# EAGLE design kitt_db01 (EAGLE 7.7.0)
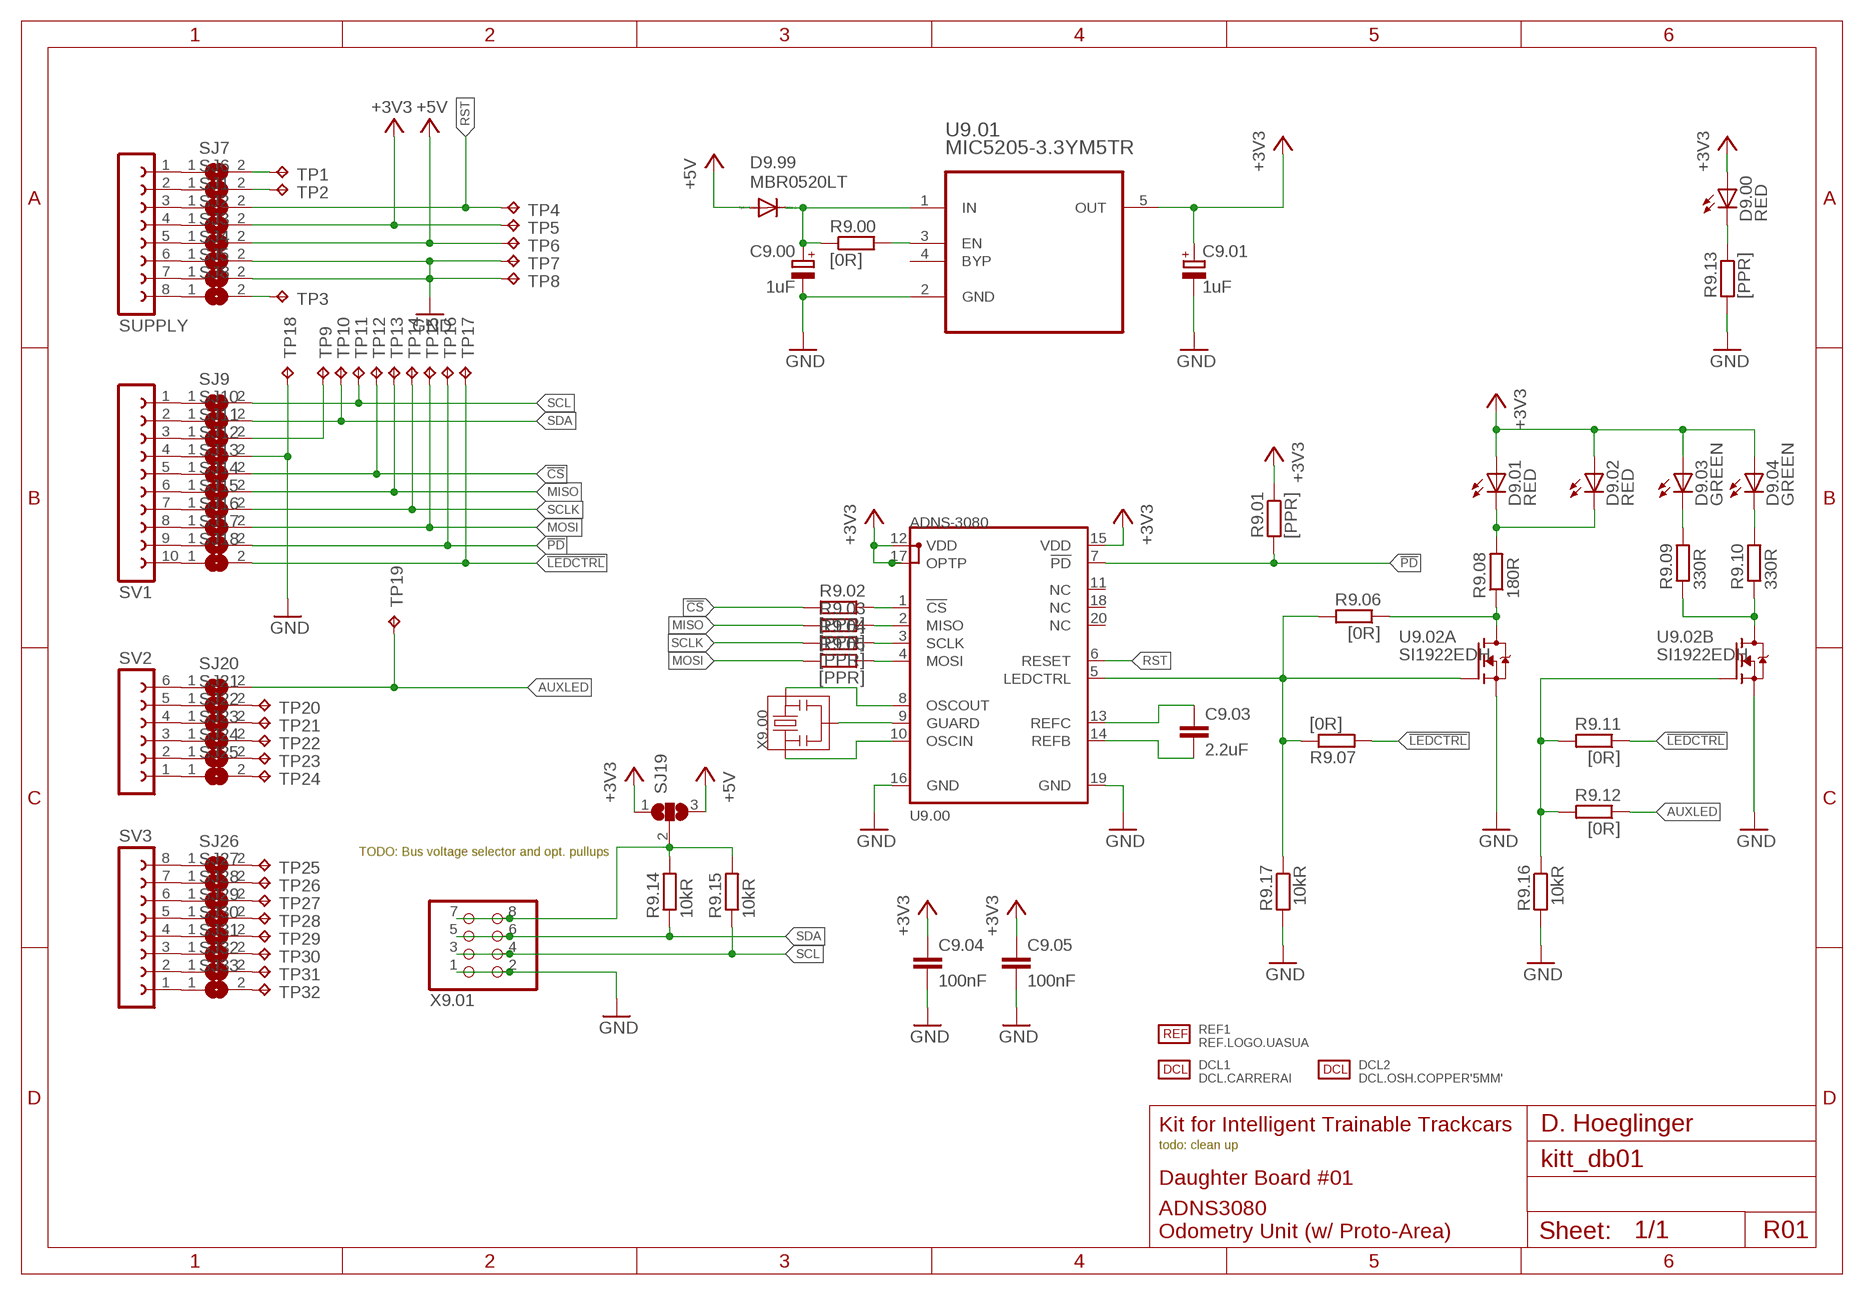
[diagram p0: schematic, sheet 1]

## Parts
C9.00  1uF  CPOL-EUA/3216-18W  [A/3216-18W]
C9.01  1uF  CPOL-EUA/3216-18W  [A/3216-18W]
C9.03  2.2uF  C-EUC1608  [C1608]
C9.04  100nF  C-EUC0805K  [C0805K]
C9.05  100nF  C-EUC0805K  [C0805K]
D9.00  RED  LEDCHIP-LED0805  [CHIP-LED0805]
D9.01  RED  LED5MM  [LED5MM]
D9.02  RED  LEDCHIP-LED0805  [CHIP-LED0805]
D9.03  GREEN  LEDCHIP-LED0805  [CHIP-LED0805]
D9.04  GREEN  LEDCHIP-LED0805  [CHIP-LED0805]
D9.99  MBR0520LT  [SOD123]
DCL1  DCL.CARRERAI  [DCL.LOGO-CARRERAI.W30MM]
DCL2  DCL.OSH.COPPER'5MM'  [DCL.LOGO-OSH.5MM]
R9.00  [0R]  R-EU_R0805  [R0805]
R9.01  [PPR]  R-EU_R0805  [R0805]
R9.02  [PPR]  R-EU_R0805  [R0805]
R9.03  [PPR]  R-EU_R0805  [R0805]
R9.04  [PPR]  R-EU_R0805  [R0805]
R9.05  [PPR]  R-EU_R0805  [R0805]
R9.06  [0R]  R-EU_R0805  [R0805]
R9.07  [0R]  R-EU_R0805  [R0805]
R9.08  180R  R-EU_R0805  [R0805]
R9.09  330R  R-EU_R0805  [R0805]
R9.10  330R  R-EU_R0805  [R0805]
R9.11  [0R]  R-EU_R0805  [R0805]
R9.12  [0R]  R-EU_R0805  [R0805]
R9.13  [PPR]  R-EU_R0805  [R0805]
R9.14  10kR  R-EU_R0805  [R0805]
R9.15  10kR  R-EU_R0805  [R0805]
R9.16  10kR  R-EU_R0805  [R0805]
R9.17  10kR  R-EU_R0805  [R0805]
REF1  REF.LOGO.UASUA  [REF_LOGO_UASUA]
SJ1  SJ  [SJ]
SJ2  SJ  [SJ]
SJ3  SJ  [SJ]
SJ4  SJ  [SJ]
SJ5  SJ  [SJ]
SJ6  SJ  [SJ]
SJ7  SJ  [SJ]
SJ8  SJ  [SJ]
SJ9  SJ  [SJ]
SJ10  SJ  [SJ]
SJ11  SJ  [SJ]
SJ12  SJ  [SJ]
SJ13  SJ  [SJ]
SJ14  SJ  [SJ]
SJ15  SJ  [SJ]
SJ16  SJ  [SJ]
SJ17  SJ  [SJ]
SJ18  SJ  [SJ]
SJ19  SJ2W  [SJ_2]
SJ20  SJ  [SJ]
SJ21  SJ  [SJ]
SJ22  SJ  [SJ]
SJ23  SJ  [SJ]
SJ24  SJ  [SJ]
SJ25  SJ  [SJ]
SJ26  SJ  [SJ]
SJ27  SJ  [SJ]
SJ28  SJ  [SJ]
SJ29  SJ  [SJ]
SJ30  SJ  [SJ]
SJ31  SJ  [SJ]
SJ32  SJ  [SJ]
SJ33  SJ  [SJ]
SUPPLY  FE08-1  [FE08]
SV1  FE10-1  [FE10]
SV2  FE06-1  [FE06]
SV3  FE08-1  [FE08]
TP1  TPPAD1-13  [P1-13]
TP2  TPPAD1-13  [P1-13]
TP3  TPPAD1-13  [P1-13]
TP4  TPPAD1-13  [P1-13]
TP5  TPPAD1-13  [P1-13]
TP6  TPPAD1-13  [P1-13]
TP7  TPPAD1-13  [P1-13]
TP8  TPPAD1-13  [P1-13]
TP9  TPPAD1-13  [P1-13]
TP10  TPPAD1-13  [P1-13]
TP11  TPPAD1-13  [P1-13]
TP12  TPPAD1-13  [P1-13]
TP13  TPPAD1-13  [P1-13]
TP14  TPPAD1-13  [P1-13]
TP15  TPPAD1-13  [P1-13]
TP16  TPPAD1-13  [P1-13]
TP17  TPPAD1-13  [P1-13]
TP18  TPPAD1-13  [P1-13]
TP19  TPPAD1-13  [P1-13]
TP20  TPPAD1-13  [P1-13]
TP21  TPPAD1-13  [P1-13]
TP22  TPPAD1-13  [P1-13]
TP23  TPPAD1-13  [P1-13]
TP24  TPPAD1-13  [P1-13]
TP25  TPPAD1-13  [P1-13]
TP26  TPPAD1-13  [P1-13]
TP27  TPPAD1-13  [P1-13]
TP28  TPPAD1-13  [P1-13]
TP29  TPPAD1-13  [P1-13]
TP30  TPPAD1-13  [P1-13]
TP31  TPPAD1-13  [P1-13]
TP32  TPPAD1-13  [P1-13]
U9.00  ADNS-3080  [ADNS-3080]
U9.01  MIC5205-3.3YM5TR  [SOT95P280X130-5N]
U9.02  SI1922EDH  [SC70-6]
X9.00  RESON  [RESON-SMD]
X9.01  PINHD-2X4/90  [2X04/90]

## Nets
!CS: R9.02.2 SJ13.2 TP12.TP
!LEDCTRL: R9.07.2 R9.11.1 SJ18.2 TP17.TP
!PD: R9.01.2 SJ17.2 TP16.TP U9.00.7(!PD)
+3V3: C9.01.+ C9.04.1 C9.05.1 D9.00.A D9.01.A D9.02.A D9.03.A D9.04.A R9.01.1 SJ2.2 SJ19.1 TP5.TP U9.00.12(VDD) U9.00.15(VDD) U9.00.17(OPTP) U9.01.5(OUT)
+5V: D9.99.A SJ3.2 SJ19.3 TP6.TP
AUXLED: R9.12.1 SJ20.2 TP19.TP
GND: C9.00.- C9.01.- C9.04.2 C9.05.2 R9.13.2 R9.16.2 R9.17.2 SJ4.2 SJ5.2 SJ12.2 TP7.TP TP8.TP TP18.TP U9.00.16(GND) U9.00.19(GND) U9.01.2(GND) U9.02.1(A:S) U9.02.4(B:S) X9.01.1 X9.01.2
MISO: R9.03.2 SJ14.2 TP13.TP
MOSI: R9.05.2 SJ16.2 TP15.TP
N$1: U9.00.9(GUARD) X9.00.2
N$2: U9.00.8(OSCOUT) X9.00.3
N$3: U9.00.10(OSCIN) X9.00.1
N$4: R9.06.2 R9.07.1 R9.17.1 U9.00.5(LEDCTRL) U9.02.2(A:G)
N$5: C9.03.1 U9.00.13(REFC)
N$6: C9.03.2 U9.00.14(REFB)
N$7: R9.06.1 R9.08.1 U9.02.6(A:D)
N$8: D9.01.K(C) D9.02.C R9.08.2
N$9: C9.00.+ D9.99.C R9.00.1 U9.01.1(IN)
N$10: R9.00.2 U9.01.3(EN)
N$11: D9.00.C R9.13.1
N$12: SJ1.1 SUPPLY.3
N$13: SJ2.1 SUPPLY.4
N$44: R9.14.2 R9.15.2 SJ19.2 X9.01.7 X9.01.8
N$134: SJ3.1 SUPPLY.5
N$135: SJ4.1 SUPPLY.6
N$136: SJ5.1 SUPPLY.7
N$137: SJ7.1 SUPPLY.1
N$138: SJ6.1 SUPPLY.2
N$139: SJ8.1 SUPPLY.8
N$140: SJ7.2 TP1.TP
N$141: SJ6.2 TP2.TP
N$142: SJ8.2 TP3.TP
N$143: SJ9.1 SV1.1
N$144: SJ10.1 SV1.2
N$145: SJ11.1 SV1.3
N$146: SJ11.2 TP9.TP
N$147: SJ12.1 SV1.4
N$148: SJ13.1 SV1.5
N$149: SJ14.1 SV1.6
N$150: SJ15.1 SV1.7
N$151: SJ16.1 SV1.8
N$152: SJ17.1 SV1.9
N$153: SJ18.1 SV1.10
N$154: SJ20.1 SV2.6
N$155: SJ21.1 SV2.5
N$156: SJ22.1 SV2.4
N$157: SJ23.1 SV2.3
N$158: SJ24.1 SV2.2
N$159: SJ25.1 SV2.1
N$160: SJ26.1 SV3.8
N$161: SJ27.1 SV3.7
N$162: SJ28.1 SV3.6
N$163: SJ29.1 SV3.5
N$164: SJ30.1 SV3.4
N$165: SJ31.1 SV3.3
N$166: SJ32.1 SV3.2
N$167: SJ33.1 SV3.1
N$168: R9.02.1 U9.00.1(!CS)
N$169: SJ21.2 TP20.TP
N$170: SJ22.2 TP21.TP
N$171: SJ23.2 TP22.TP
N$172: SJ24.2 TP23.TP
N$173: SJ25.2 TP24.TP
N$174: SJ26.2 TP25.TP
N$175: SJ27.2 TP26.TP
N$176: SJ28.2 TP27.TP
N$177: SJ29.2 TP28.TP
N$178: SJ30.2 TP29.TP
N$179: SJ31.2 TP30.TP
N$180: SJ32.2 TP31.TP
N$181: SJ33.2 TP32.TP
N$182: R9.03.1 U9.00.2(MISO)
N$183: R9.04.1 U9.00.3(SCLK)
N$184: R9.11.2 R9.12.2 R9.16.1 U9.02.5(B:G)
N$185: D9.04.C R9.10.2
N$186: R9.09.1 R9.10.1 U9.02.3(B:D)
N$187: D9.03.C R9.09.2
N$188: R9.05.1 U9.00.4(MOSI)
RST: SJ1.2 TP4.TP U9.00.6(RESET)
SCL: R9.15.1 SJ9.2 TP11.TP X9.01.3 X9.01.4
SCLK: R9.04.2 SJ15.2 TP14.TP
SDA: R9.14.1 SJ10.2 TP10.TP X9.01.5 X9.01.6
Unconnected: U9.00.11(NC) U9.00.18(NC) U9.00.20(NC) U9.01.4(BYP)

## Notes on the sheet
- TODO: Bus voltage selector and opt. pullups
- Kit for Intelligent Trainable Trackcars | D. Hoeglinger
- todo: clean up
- Daughter Board #01
- ADNS3080
  Odometry Unit (w/ Proto-Area)
- R01

## Library data of the parts
C9.00 C9.01 = rcl:CPOL-EU: POLARIZED CAPACITOR, European symbol
C9.03-C9.05 = rcl:C-EU: CAPACITOR, European symbol
D9.00 D9.01-D9.04 = led:LED: LED OSRAM: - CHIPLED LG R971, LG N971, LY N971, LG Q971, LY Q971, LO R971, LY R971 LH N974, LH R974 LS Q976, LO Q976, LY Q976 LO Q996 - Hyper CHIPLED LW Q18S LB Q993, LB Q99A, LB R99A - SideLED LS A670, LO A670, LY A670, LG A670, LP A670 LB A673, LV A673, LT A673, LW A673 LH A674 LY A675 LS A676, LA A676, LO A676, LY A676, LW A676 LS A679, LY A679, LG A679 - Hyper Micro SIDELED® LS Y876, LA Y876, LO Y876, LY Y876 LT Y87S - SmartLED LW L88C, LW L88S LB L89C, LB L89S, LG L890 LS L89K, LO L89K, LY L89K LS L896, LA L896, LO L896, LY L896 - TOPLED LS T670, LO T670, LY T670, LG T670, LP T670 LSG T670, LSP T670, LSY T670, LOP T670, LYG T670 LG T671, LOG T671, LSG T671 LB T673, LV T673, LT T673, LW T673 LH T674 LS T676, LA T676, LO T676, LY T676, LB T676, LH T676, LSB T676, LW T676 LB T67C, LV T67C, LT T67C, LS T67K, LO T67K, LY T67K, LW E67C LS E67B, LA E67B, LO E67B, LY E67B, LB E67C, LV E67C, LT E67C LW T67C LS T679, LY T679, LG T679 LS T770, LO T770, LY T770, LG T770, LP T770 LB T773, LV T773, LT T773, LW T773 LH T774 LS E675, LA E675, LY E675, LS T675 LS T776, LA T776, LO T776, LY T776, LB T776 LHGB T686 LT T68C, LB T68C - Hyper Mini TOPLED® LB M676 - Mini TOPLED Santana® LG M470 LS M47K, LO M47K, LY M47K Source: http://www.osram.convergy.de LUXEON: - LUMILED® LXK2-PW12-R00, LXK2-PW12-S00, LXK2-PW14-U00, LXK2-PW14-V00 LXK2-PM12-R00, LXK2-PM12-S00, LXK2-PM14-U00 LXK2-PE12-Q00, LXK2-PE12-R00, LXK2-PE12-S00, LXK2-PE14-T00, LXK2-PE14-U00 LXK2-PB12-K00, LXK2-PB12-L00, LXK2-PB12-M00, LXK2-PB14-N00, LXK2-PB14-P00, LXK2-PB14-Q00 LXK2-PR12-L00, LXK2-PR12-M00, LXK2-PR14-Q00, LXK2-PR14-R00 LXK2-PD12-Q00, LXK2-PD12-R00, LXK2-PD12-S00 LXK2-PH12-R00, LXK2-PH12-S00 LXK2-PL12-P00, LXK2-PL12-Q00, LXK2-PL12-R00 Source: www.luxeon.com KINGBRIGHT: KA-3528ASYC Source: www.kingbright.com
D9.99 = diode:MBR0520LT: SCHOTTKY BARRIER RECTIFIER Source: http://onsemi.com .. MBR0520LT1-D.pdf
DCL1 = kitt.refs:DCL.CARRERAI
DCL2 = kitt.refs:DCL.OSH.COPPER
R9.00 R9.01-R9.09 R9.10-R9.17 = rcl:R-EU_: RESISTOR, European symbol
REF1 = kitt.refs:REF.LOGO.UASUA
SJ1-SJ18 SJ20-SJ33 = jumper:SJ: SMD solder JUMPER
SJ19 = jumper:SJ2W: SMD solder JUMPER
SUPPLY SV3 = con-lsta:FE08-1: FEMALE HEADER; OC_FARNELL: unknown; OC_NEWARK: unknown
SV1 = con-lsta:FE10-1: FEMALE HEADER; OC_FARNELL: unknown; OC_NEWARK: unknown
SV2 = con-lsta:FE06-1: FEMALE HEADER; OC_FARNELL: unknown; OC_NEWARK: unknown
TP1-TP32 = testpad:TP: Test pad
U9.00 = Ai_IC:ADNS-3080
U9.01 = kitt.ic:MIC5205-3.3YM5TR: 150mA Low-Noise LDO Regulator; AVAILABILITY: Good; DESCRIPTION: MIC5205 Series 3.3 V Fixed Output 150 mA Low-Noise LDO Regulator - SOT-23-5; MF: Microchip; MP: MIC5205-3.3YM5-TR; PACKAGE: SOT-23-5 Microchip; PRICE: 0.36 USD
U9.02 = kitt.ic:SI1922EDH
X9.00 = Ai_Passives:RESON
X9.01 = pinhead:PINHD-2X4: PIN HEADER

## Board
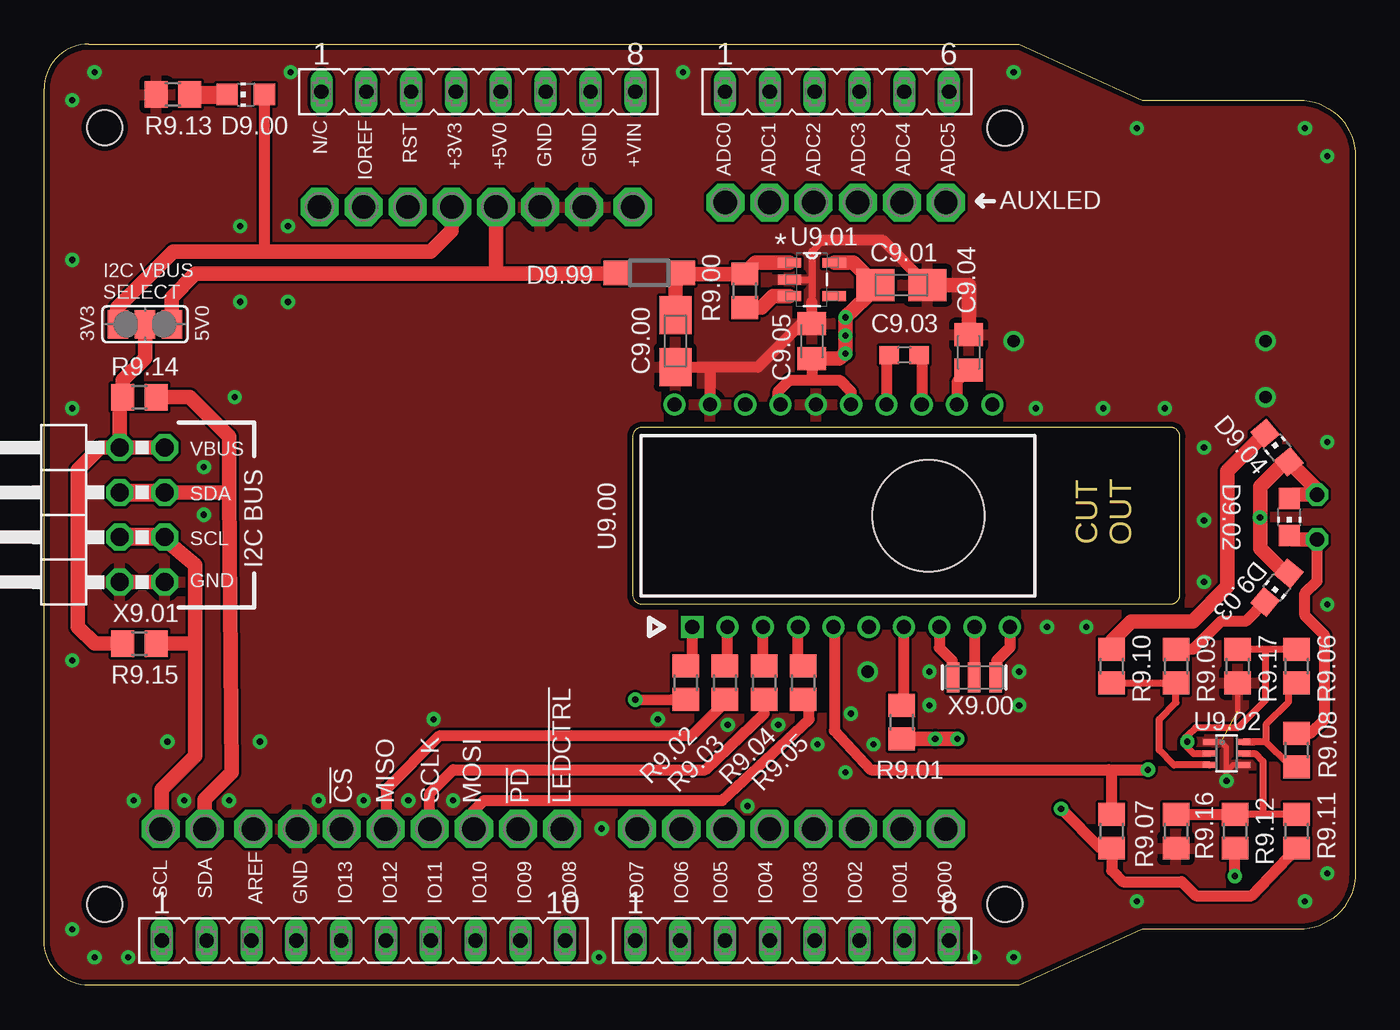
[diagram p1: board, top side]
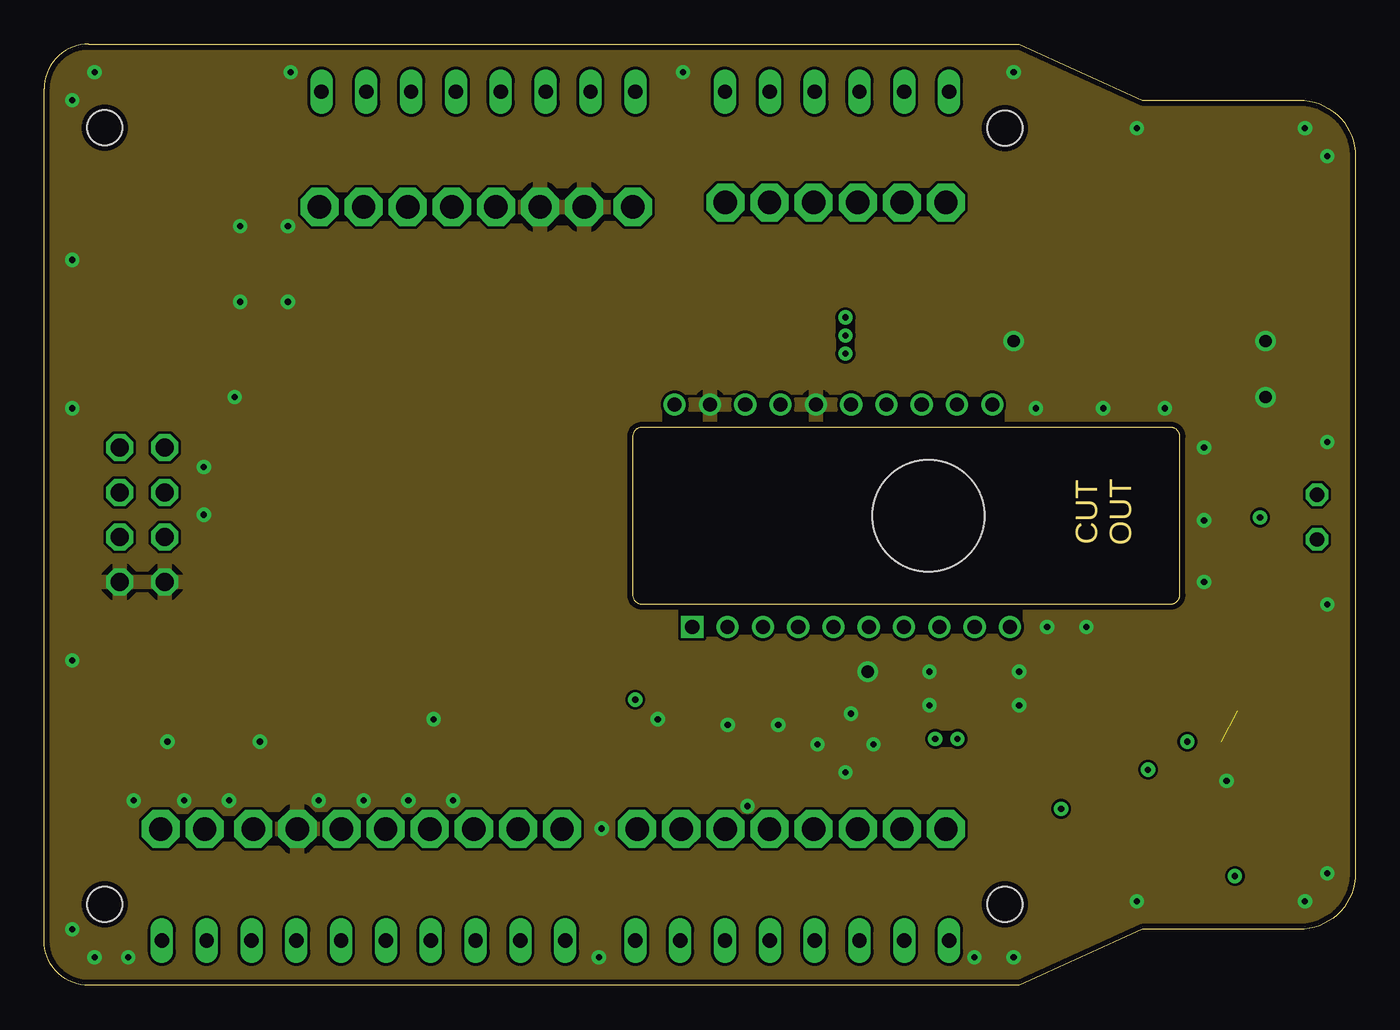
[diagram p2: board, inner layer Route2]
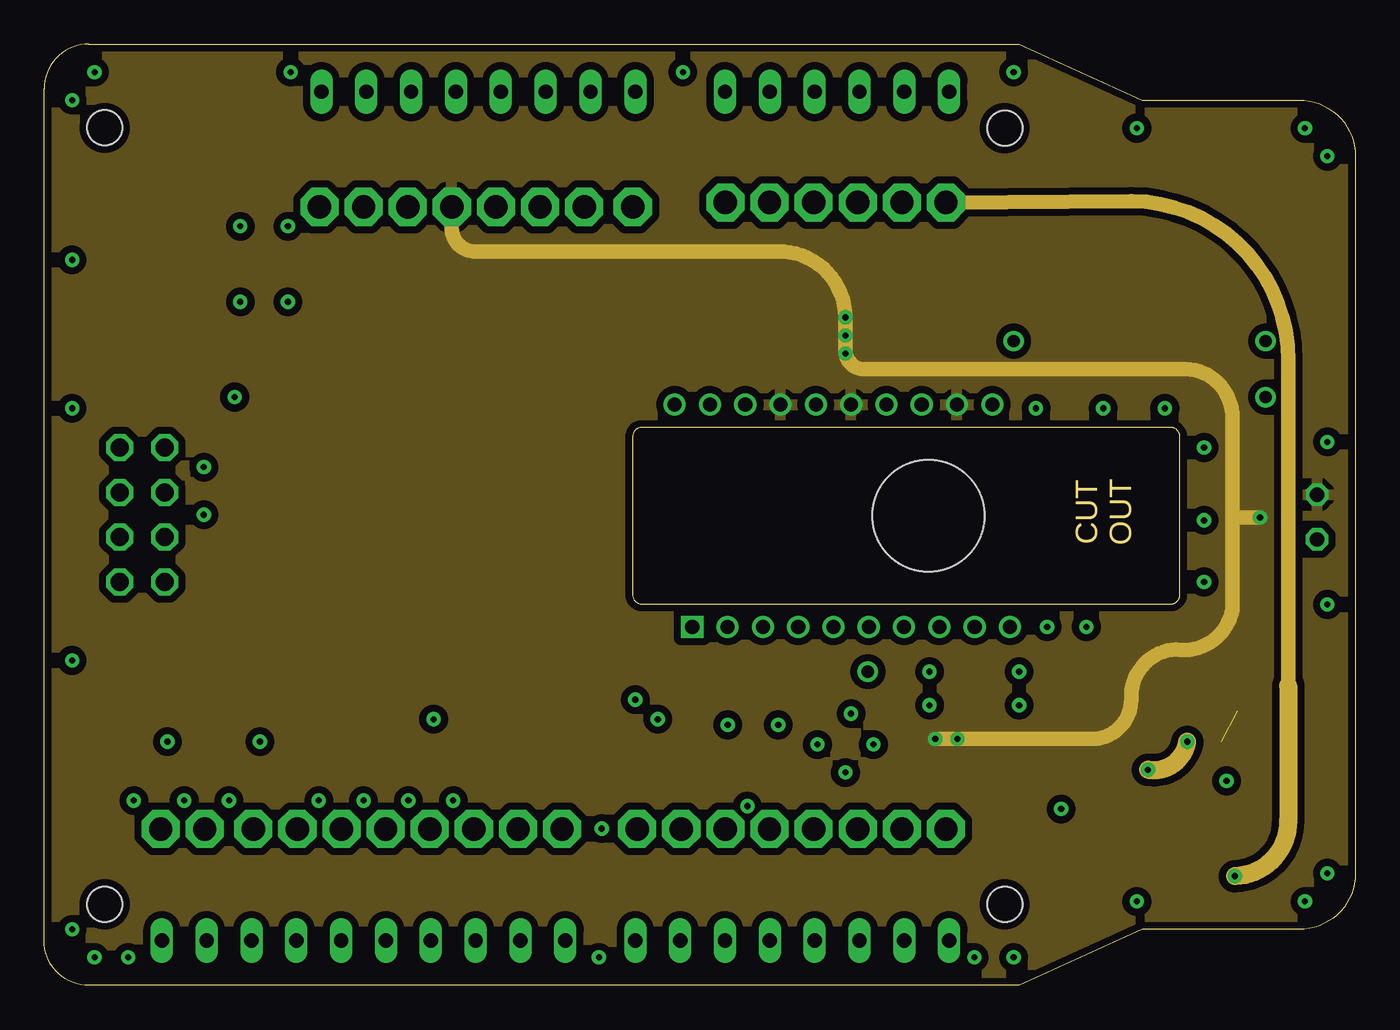
[diagram p3: board, inner layer Route3]
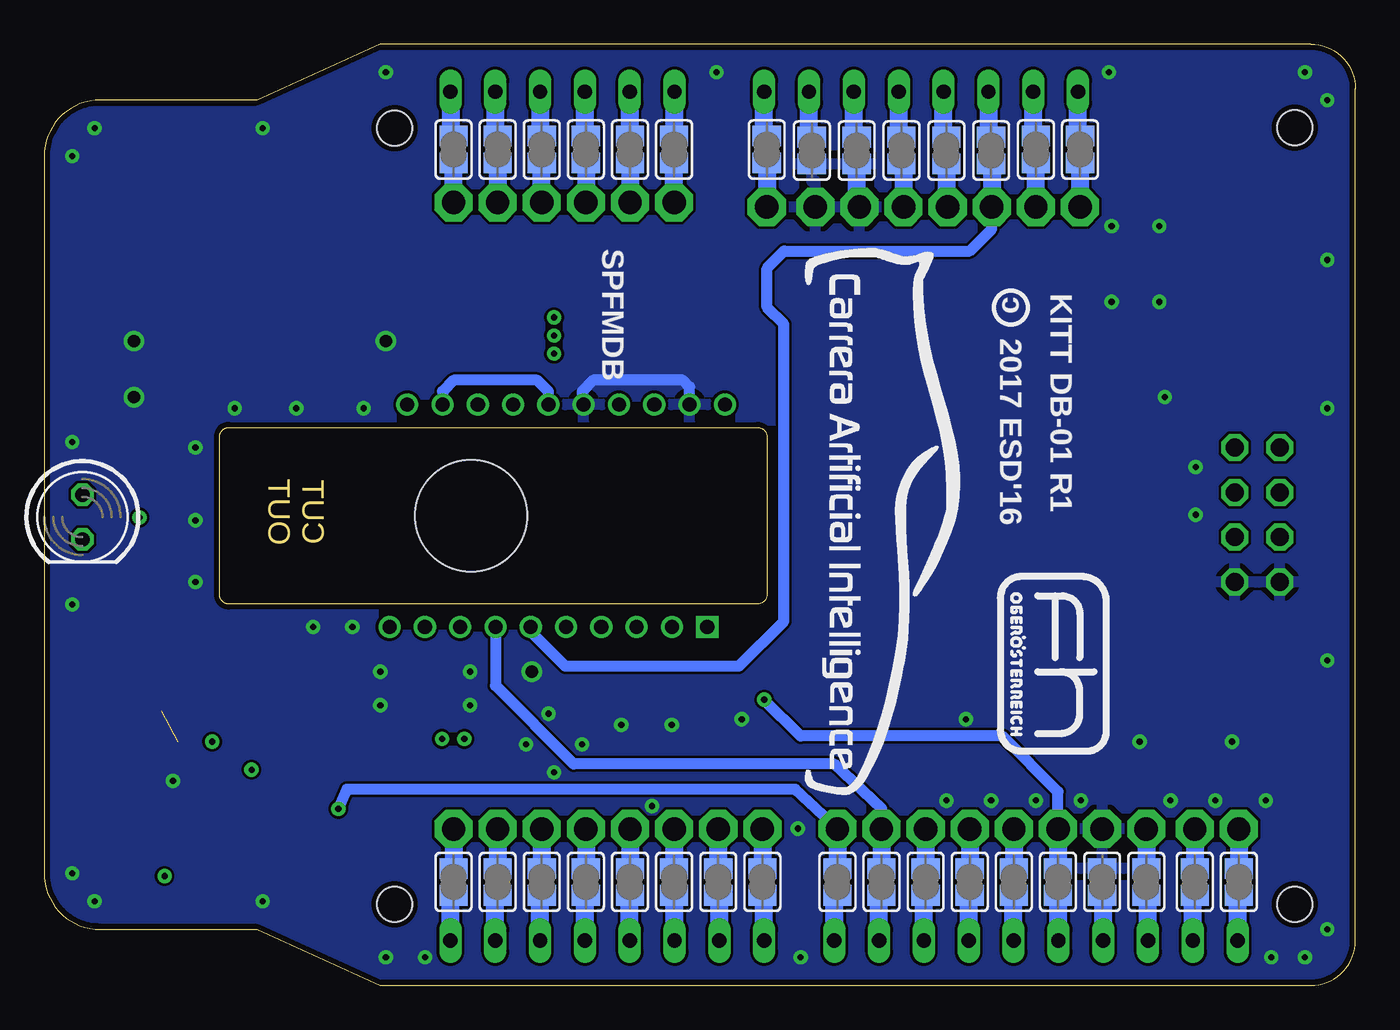
[diagram p4: board, bottom side, seen from below]

Size 74.3 x 53.34 mm. Coordinates in mm from the lower left corner, seen from the top.
Outline: 33.35,31.12 33.35,22.12 arc90 33.85,21.62 63.85,21.62 arc90 64.35,22.12 64.35,31.12 arc90 63.85,31.62 33.85,31.62 arc90 33.35,31.12
Outline: 2.54,53.34 arc90 0,50.8 0,2.54 arc90 2.54,0 55.25,0 62.23,3.17 71.12,3.17 arc90 74.3,6.35 74.3,46.99 arc90 71.12,50.16 62.23,50.16 55.25,53.34 2.54,53.34
Copper layers (1*2+3*4+5*6+7*16): Top 0.035mm / dielectric 0.2mm / Route2 0.035mm / dielectric 0.15mm / Route3 0.035mm / dielectric 0.2mm / layer 4 0.035mm / dielectric 0.15mm / layer 5 0.035mm / dielectric 0.2mm / layer 6 0.035mm / dielectric 0.15mm / layer 7 0.035mm / dielectric 0.2mm / Bottom 0.035mm
Design rules "Eagle_WEdirekt_150_check": minimum track width 6mil, minimum drill 0.25mm, track to track 6mil, track to pad 8mil, pad to pad 8mil, via to via 6mil, smd to smd 8mil, copper to edge 12mil, drill to drill 24mil, minimum pad ring 9mil, minimum via ring 9mil, stop-mask expansion 3mil, vias tented up to drill 0mil, thermal gap 12mil
Holes 2 mm at 3.43,48.59 54.43,48.58 54.43,4.6 3.43,4.6
tRestrict: area 33.7,21.9 to 64.1,31.4
bRestrict: area 33.7,21.9 to 64.1,31.4

### Footprints (pad centres in the part's own frame; a part is rotated, then mirrored left to right if it is on the bottom)
A/3216-18W = smd 2.15 x 1.8: + 1.475,0; - -1.475,0
C1608 = smd 1.1 x 1: 1 -0.85,0; 2 0.85,0
C0805K = smd 1.3 x 1.6: 1 -1,0; 2 1,0
CHIP-LED0805 = smd 1.2 x 1.2: A 0,-1.05; C 0,1.05
LED5MM = drill 0.813 octagon: A -1.27,0; K 1.27,0
SOD123 = smd 1.4 x 1.4: A 1.9,0; C -1.9,0
R0805 = smd 1.3 x 1.5: 1 -0.95,0; 2 0.95,0
SJ = smd 1.168 x 1.6: 1 -0.762,0; 2 0.762,0
SJ_2 = smd 1.168 x 1.6: 1 -1.524,0; 2 0,0; 3 1.524,0
FE08 = drill 0.813 long: 1 -8.89,0; 2 -6.35,0; 3 -3.81,0; 4 -1.27,0; 5 1.27,0; 6 3.81,0; 7 6.35,0; 8 8.89,0
FE10 = drill 0.813 long: 1 -11.43,0; 2 -8.89,0; 3 -6.35,0; 4 -3.81,0; 5 -1.27,0; 6 1.27,0; 7 3.81,0; 8 6.35,0; 9 8.89,0; 10 11.43,0
FE06 = drill 0.813 long: 1 -6.35,0; 2 -3.81,0; 3 -1.27,0; 4 1.27,0; 5 3.81,0; 6 6.35,0
P1-13 = drill 1.321 pad 2.159 octagon: TP 0,0
ADNS-3080 = drill 0.8 square: 1 -8.126,-6.3 | drill 0.8: 2 -6.126,-6.3; 3 -4.126,-6.3; 4 -2.126,-6.3; 5 -0.126,-6.3; 6 1.874,-6.3; 7 3.874,-6.3; 8 5.874,-6.3; 9 7.874,-6.3; 10 9.874,-6.3; 11 8.874,6.3; 12 6.874,6.3; 13 4.874,6.3; 14 2.874,6.3; 15 0.874,6.3; 16 -1.126,6.3; 17 -3.126,6.3; 18 -5.126,6.3; 19 -7.126,6.3; 20 -9.126,6.3 | hole 6.35: 5.254,0
SOT95P280X130-5N = smd 1.321 x 0.559: 1 -1.27,0.94; 2 -1.27,0; 3 -1.27,-0.94; 4 1.27,-0.94; 5 1.27,0.94
SC70-6 = smd 0.35 x 0.8: 1 -0.65,-0.95; 2 0,-0.95; 3 0.65,-0.95; 4 0.65,0.95; 5 0,0.95; 6 -0.65,0.95
RESON-SMD = smd 0.7 x 1.7: 1 -1.2,0; 2 0,0; 3 1.2,0
2X04/90 = drill 1.016 octagon: 1 -3.81,-6.35; 2 -3.81,-3.81; 3 -1.27,-6.35; 4 -1.27,-3.81; 5 1.27,-6.35; 6 1.27,-3.81; 7 3.81,-6.35; 8 3.81,-3.81

### Placement (x,y rotation side)
C9.00  35.77,36.51 90 top
C9.01  48.58,39.69 180 top
C9.03  48.74,35.72 180 top
C9.04  52.39,35.88 90 top
C9.05  43.5,36.51 90 top
D9.00  11.43,50.48 90 top
D9.01  72.13,26.54 270 bottom
D9.02  70.55,26.54 180 top
D9.03  69.85,22.54 140 top
D9.04  69.85,30.48 40 top
D9.99  34.29,40.37 180 top
DCL1  28.58,26.51 270 bottom
DCL2  38.42,38.42 270 bottom
R9.00  39.69,39.37 270 top
R9.01  48.58,14.92 90 top
R9.02  36.35,17.15 270 top
R9.03  38.58,17.15 270 top
R9.04  40.8,17.15 270 top
R9.05  43.02,17.15 270 top
R9.06  70.96,18.1 90 top
R9.07  60.48,8.73 270 top
R9.08  70.96,13.33 90 top
R9.09  64.14,18.1 90 top
R9.10  60.48,18.1 90 top
R9.11  70.96,8.73 90 top
R9.12  67.47,8.73 90 top
R9.13  7.3,50.48 180 top
R9.14  5.4,33.34 180 top
R9.15  5.4,19.37 180 top
R9.16  64.14,8.73 270 top
R9.17  67.63,18.1 270 top
REF1  21.11,23.18 270 bottom
SJ1  20.64,47.31 270 bottom
SJ2  23.18,47.31 270 bottom
SJ3  25.72,47.31 270 bottom
SJ4  28.26,47.31 270 bottom
SJ5  30.8,47.31 270 bottom
SJ6  18.1,47.37 270 bottom
SJ7  15.6,47.37 270 bottom
SJ8  33.35,47.37 270 bottom
SJ9  6.6,5.87 90 bottom
SJ10  9.1,5.87 90 bottom
SJ11  11.85,5.87 90 bottom
SJ12  14.35,5.87 90 bottom
SJ13  16.85,5.87 90 bottom
SJ14  19.35,5.87 90 bottom
SJ15  21.85,5.87 90 bottom
SJ16  24.35,5.87 90 bottom
SJ17  26.85,5.87 90 bottom
SJ18  29.35,5.87 90 bottom
SJ19  5.71,37.47 0 top
SJ20  51.1,47.37 270 bottom
SJ21  48.6,47.37 270 bottom
SJ22  46.1,47.37 270 bottom
SJ23  43.6,47.37 270 bottom
SJ24  41.1,47.37 270 bottom
SJ25  38.6,47.37 270 bottom
SJ26  51.1,5.87 90 bottom
SJ27  48.6,5.87 90 bottom
SJ28  46.1,5.87 90 bottom
SJ29  43.6,5.87 90 bottom
SJ30  41.1,5.87 90 bottom
SJ31  38.6,5.87 90 bottom
SJ32  36.1,5.87 90 bottom
SJ33  33.6,5.87 90 bottom
SUPPLY  24.61,50.64 0 top
SV1  18.1,2.54 0 top
SV2  44.93,50.64 0 top
SV3  42.39,2.54 0 top
TP1  15.6,44.12 180 top
TP2  18.1,44.12 180 top
TP3  33.35,44.12 180 top
TP4  20.6,44.12 180 top
TP5  23.1,44.12 180 top
TP6  25.6,44.12 180 top
TP7  30.6,44.12 180 top
TP8  28.1,44.12 180 top
TP9  11.85,8.87 0 top
TP10  9.1,8.87 0 top
TP11  6.6,8.87 0 top
TP12  16.85,8.87 0 top
TP13  19.35,8.87 0 top
TP14  21.85,8.87 0 top
TP15  24.35,8.87 0 top
TP16  26.85,8.87 0 top
TP17  29.35,8.87 0 top
TP18  14.35,8.87 0 top
TP19  51.1,44.37 180 top
TP20  48.6,44.37 180 top
TP21  46.1,44.37 180 top
TP22  43.6,44.37 180 top
TP23  41.1,44.37 180 top
TP24  38.6,44.37 180 top
TP25  51.1,8.87 0 top
TP26  48.6,8.87 0 top
TP27  46.1,8.87 0 top
TP28  43.6,8.87 0 top
TP29  41.1,8.87 0 top
TP30  38.6,8.87 0 top
TP31  36.1,8.87 0 top
TP32  33.6,8.87 0 top
U9.00  44.85,26.62 0 top
U9.01  43.5,40.01 0 top
U9.02  66.99,13.15 270 top
U$2  [A4L-LOC]  -94.77,-68.58 0 top  (outside the outline)
X9.00  52.7,17.46 180 top
X9.01  0.48,26.67 90 top

### Tracks (layer width: path | path; a pad name or v marks a point on that pad's centre or on a via)
!CS  (via drill 0.35)
  Top 0.61: 16.83,8.89 TP12.TP | v33.5,16.19 35.56,16.19 R9.02.2
  Bottom 0.61: TP12.TP 16.85,10.98 20,14.13 31.43,14.13 v33.5,16.19
  Bottom 1.016: TP12.TP SJ13.2
!LEDCTRL  (via drill 0.35)
  Top 0.61: R9.11.1 68.42,5.08 65.25,5.08 64.45,5.87 61.12,5.87 60.48,6.51 R9.07.2 59.85,7.78 v57.63,10
  Bottom 0.61: TP17.TP 31.75,11.11 57.15,11.11 v57.63,10
  Bottom 1.016: TP17.TP SJ18.2
!PD
  Top 0.61: R9.01.2 48.72,16.02 U9.00.7
  Bottom 0.61: U9.00.7 48.72,16.99 44.29,12.55 44.29,12.54 29.53,12.54 26.85,10.02 TP16.TP
  Bottom 1.016: TP16.TP SJ17.2
+3V3  (via drill 0.35)
  Top 0.61: C9.04.1 51.72,34.21 U9.00.12 | U9.00.17 41.59,33.05 41.59,33.65 42.23,34.29 43.5,34.29 | 43.5,34.29 45.08,34.29 45.72,33.65 U9.00.15 | C9.05.1 43.5,34.29 | R9.01.1 | 45.4,36.51 v45.4,36.83 | 12.54,50.42 12.7,50.42 | TP5.TP | D9.00.A 12.48,41.59 12.06,41.59
  Top 0.813: U9.01.5 45.84,40.94 C9.01.+ 47.1,39.48 v45.4,37.86 v45.4,36.83 v45.4,35.8 45.04,35.51 C9.05.1 | R9.01.1 v51.75,13.97 | 70.53,27.62 D9.02.A 70.77,27.81 D9.01.A 72.13,28.07 D9.04.A 70.32,29.68 68.9,28.26 v68.9,26.51 68.9,24.76 70.32,23.35 D9.03.A | D9.00.A 12.54,50.42 | TP5.TP 23.1,42.78 21.91,41.59 12.06,41.59 7.3,41.59 4.13,38.42 4.13,37.53 SJ19.1
  Route3 0.813: v50.48,13.97 v51.75,13.97 59.37,13.97 arc90 61.59,16.19 arc-90 64.14,19.05 arc90 67.31,21.27 67.31,26.51 | 67.31,26.51 67.31,32.39 arc90 64.45,34.93 46.51,34.93 arc-81 v45.4,35.8 v45.4,36.83 v45.4,37.86 arc90 41.59,41.59 24.45,41.59 arc-90 23.1,42.86 TP5.TP | v68.9,26.51 67.31,26.51
  Bottom 0.61: U9.00.15 45.72,33.66 46.36,34.29 51.09,34.29 51.72,33.65 U9.00.12
  Bottom 1.016: SJ2.2 23.18,44.12 TP5.TP
  pour Route3 (isolate 0.406): 0,50.8 0,2.54 arc90 2.54,0 55.25,0 62.23,3.17 71.12,3.17 arc90 74.3,6.35 74.3,47.31 arc90 71.44,50.16 62.23,50.16 55.25,53.34 2.22,53.34 arc98
+5V
  Top 0.813: SJ19.3 7.24,38.99 8.57,40.32 25.6,40.32 | 25.6,40.32 32.39,40.32 D9.99.A | TP6.TP 25.6,40.32
  Bottom 0.813: 25.6,46.55 SJ3.2
  Bottom 1.016: 25.6,46.55 TP6.TP
AUXLED  (via drill 0.35)
  Top 0.61: v67.47,6.19 R9.12.1
  Route3 0.813: 70.48,16.99 70.48,35.4 arc90 61.59,44.45 TP19.TP
  Route3 1.016: 70.48,16.99 70.48,9.37 arc-90 v67.47,6.19
  Bottom 1.016: TP19.TP SJ20.2
GND  (via drill 0.35, 0.7)  (1 unrouted)
  Top 0.305: U9.02.1 66.69,13.79 66.99,13.49 66.99,12.06 67.36,12.49 U9.02.4 | R9.17.2 67.63,15.56
  Top 0.406: 43.5,40.01 43.5,38.73 | U9.01.2 43.5,40.01 | 44.13,42.23 43.5,41.59 43.5,40.01
  Top 0.61: C9.00.- 37.72,35.04 | 37.72,35.04 40.44,35.04 42.91,37.51 C9.05.2 43.5,38.73 | 37.72,35.04 U9.00.19 | C9.01.- 47.51,42.23 44.13,42.23
  Top 0.813: C9.01.- 52.39,39.69 C9.04.2 | X9.01.2 X9.01.1
  Top 1.016: TP8.TP 28.26,44.27
  Bottom 0.61: U9.00.19 37.72,33.91 38.1,34.29 43.18,34.29 43.81,33.65 43.81,33.01 U9.00.16
  Bottom 1.016: SJ4.2 28.26,44.12 TP8.TP
  other vias: 69.22,36.51 69.22,33.34 54.93,36.51 46.67,17.78 66.99,11.59 2.86,51.75 13.97,51.75 36.2,51.75 54.93,51.75 61.91,48.58 71.44,48.58 72.71,46.99 72.71,6.35 71.44,4.76 61.91,4.76 54.93,1.59 52.7,1.59 31.43,1.59 4.76,1.59 2.86,1.59 1.59,3.17 1.59,18.41 1.59,32.7 1.59,50.16 55.25,17.78 55.25,15.87 50.17,15.87 50.17,17.78 45.4,12.06 43.81,13.65 46.99,13.65 20.64,10.48 23.18,10.48 38.73,14.76 41.59,14.76 45.72,15.4 39.85,10.16 31.59,8.89 34.77,15.08 22.07,15.08 18.1,10.48 15.56,10.48 7.94,10.48 9.05,26.67 9.05,29.37 10.48,10.48 5.08,10.48 6.98,13.81 12.22,13.81 10.8,33.34 11.11,38.73 13.81,43.02 11.11,43.02 13.81,38.73 1.59,41.12 72.71,30.8 72.71,21.59 56.2,32.7 63.5,32.7 65.72,22.86 65.72,30.48 56.83,20.32 59.05,20.32 65.72,26.35 60.01,32.7
  pour Top: 2.54,52.7 arc90 0.63,50.8 0.63,2.54 arc90 2.54,0.63 55.25,0.63 62.23,3.81 71.12,3.81 arc90 73.66,6.35 73.66,47.31 arc90 71.44,49.53 62.23,49.53 55.25,52.7
  pour Bottom: 2.54,52.7 arc90 0.63,50.8 0.63,2.54 arc90 2.54,0.63 55.25,0.63 62.23,3.81 71.12,3.81 arc90 73.66,6.35 73.66,47.31 arc90 71.44,49.53 62.23,49.53 55.25,52.7
  pour Route2: 0.35,2.62 0.35,51.11 arc-90 2.35,53.11 55.35,53.11 62.35,49.62 71.35,49.62 arc-90 73.85,47.12 73.85,6.12 arc-90 71.35,3.62 62.35,3.62 55.35,0.62 2.35,0.62 arc-90
MISO
  Top 0.61: 38.58,16.03 R9.03.2 38.26,15.88 38.26,15.72 36.67,14.13 22.38,14.13 19.37,11.11 19.37,8.88 TP13.TP
  Route3 0.61: TP13.TP 19.37,8.88
  Bottom 1.016: TP13.TP SJ14.2
MOSI
  Top 0.61: R9.05.2 arc-90 43.34,15.88 43.34,15.08 38.42,10.48 24.92,10.48 24.29,9.84 24.29,8.93 TP15.TP
  Bottom 1.016: TP15.TP SJ16.2
N$1
  Top 0.61: U9.00.9 52.7,20.3 X9.00.2
N$2
  Top 0.61: U9.00.8 50.72,19.13 51.44,18.42 51.44,17.53 X9.00.3
N$3
  Top 0.61: U9.00.10 54.72,19.16 53.97,18.42 53.97,17.53 X9.00.1
N$4  (via drill 0.35)
  Top 0.406: U9.02.2 65.12,13.15 64.77,13.49 v64.77,13.81 | 64.77,13.97 64.77,14.13 65.25,14.6 67.63,14.6 69.22,16.19 69.22,19.05 | 69.22,19.05 R9.17.1 | R9.06.2 69.22,19.05
  Top 0.61: U9.00.5 44.77,20.27 44.77,14.45 46.83,12.22 60.33,12.22 | 60.33,12.22 v62.55,12.22 | v64.77,13.81 64.77,13.97 | R9.07.1 60.48,12.06 60.33,12.22
  Route3 1.016: v62.55,12.22 arc90 v64.77,13.81
N$5
  Top 0.61: C9.03.1 49.72,35.52 U9.00.13
N$6
  Top 0.61: C9.03.2 47.72,35.55 U9.00.14
N$7
  Top 0.406: 69.23,13.79 70.48,12.54 70.89,12.54 R9.08.1 | 68.56,13.79 U9.02.6 69.23,13.79 | R9.06.1 70.49,17.15 70.49,16.04 69.23,14.78 69.23,13.79
N$8
  Top 0.61: 72.07,25.22 D9.01.K 72.13,22.91 71.44,22.22 71.44,20.95 72.55,19.84 72.55,15.08 71.75,14.28 R9.08.2
  Top 0.813: D9.02.C arc90 70.77,25.27 D9.01.K
N$9
  Top 0.813: 36.24,40.32 R9.00.1 40.31,40.94 U9.01.1 | 36.24,40.32 arc-90 D9.99.C | 36.24,40.32 35.77,40.32 C9.00.+
N$10
  Top 0.813: R9.00.2 40.64,38.42 41.29,39.07 U9.01.3
N$11
  Top 1.016: R9.13.1 D9.00.C
N$12
  Bottom 0.813: 20.8,48.23 SJ1.1
  Bottom 1.016: SUPPLY.3 20.8,48.07 SJ1.1
N$13
  Bottom 0.813: 23.34,48.23 SJ2.1
  Bottom 1.016: 23.34,48.23 SUPPLY.4
N$44
  Top 0.813: X9.01.8 X9.01.7 | X9.01.8 3.18,30.48 1.91,29.21 1.91,20.32 2.86,19.37 R9.15.2 | X9.01.8 4.29,33.34 R9.14.2 4.45,34.29 5.71,35.56 SJ19.2
N$134
  Bottom 0.813: 25.88,48.23 SJ3.1
  Bottom 1.016: 25.88,48.23 SUPPLY.5
N$135
  Bottom 0.813: 28.42,48.23 SJ4.1
  Bottom 1.016: 28.42,48.23 SUPPLY.6
N$136
  Bottom 0.813: 30.96,48.23 SJ5.1
  Bottom 1.016: 30.96,48.23 SUPPLY.7
N$137
  Bottom 1.016: SJ7.1 15.72,48.13 SUPPLY.1
N$138
  Bottom 1.016: SJ6.1 18.26,48.13 SUPPLY.2
N$139
  Bottom 1.016: SJ8.1 33.5,48.27 SUPPLY.8
N$140
  Bottom 1.016: SJ7.2 TP1.TP
N$141
  Bottom 1.016: TP2.TP SJ6.2
N$142
  Bottom 1.016: SJ8.2 TP3.TP
N$143
  Bottom 1.016: SV1.1 6.67,5.1 SJ9.1
N$144
  Bottom 1.016: 9.21,5 SJ10.1 9.21,5.1 SV1.2
N$145
  Bottom 1.016: 11.75,5 SJ11.1 11.75,5.1 SV1.3
N$146
  Bottom 1.016: TP9.TP SJ11.2
N$147
  Bottom 1.016: 14.29,5.04 SJ12.1 14.29,5.1 SV1.4
N$148
  Bottom 1.016: 16.83,5.08 SJ13.1 16.83,5.1 SV1.5
N$149
  Bottom 1.016: 19.37,5.09 SJ14.1 19.37,5.1 SV1.6
N$150
  Bottom 1.016: 21.91,5.05 SJ15.1 21.91,5.1 SV1.7
N$151
  Bottom 1.016: 24.45,5.01 SJ16.1 24.45,5.1 SV1.8
N$152
  Bottom 1.016: 26.99,4.97 SJ17.1 26.99,5.1 SV1.9
N$153
  Bottom 1.016: 29.53,4.93 SJ18.1 29.53,5.1 SV1.10
N$154
  Bottom 1.016: SV2.6 51.28,48.13 SJ20.1
N$155
  Bottom 1.016: SV2.5 48.74,48.13 SJ21.1
N$156
  Bottom 1.016: SV2.4 46.2,48.13 SJ22.1
N$157
  Bottom 1.016: SJ23.1 43.66,48.18 SV2.3
N$158
  Bottom 1.016: 41.12,48.14 SJ24.1 41.12,48.13 SV2.2
N$159
  Bottom 1.016: SJ25.1 38.58,48.15 SV2.1
N$160
  Bottom 1.016: 51.28,4.93 SJ26.1 51.28,5.1 SV3.8
N$161
  Bottom 1.016: 48.74,4.97 SJ27.1 48.74,5.1 SV3.7
N$162
  Bottom 1.016: 46.2,5.01 SJ28.1 46.2,5.1 SV3.6
N$163
  Bottom 1.016: 43.66,5.05 SJ29.1 43.66,5.1 SV3.5
N$164
  Bottom 1.016: 41.12,5.09 SJ30.1 41.12,5.1 SV3.4
N$165
  Bottom 1.016: 38.58,5.08 SJ31.1 38.58,5.1 SV3.3
N$166
  Bottom 1.016: 36.04,5.04 SJ32.1 36.04,5.1 SV3.2
N$167
  Bottom 1.016: 33.5,5 SJ33.1 33.5,5.1 SV3.1
N$168
  Top 0.61: R9.02.1 36.72,18.47 U9.00.1
N$169
  Bottom 1.016: SJ21.2 TP20.TP
N$170
  Bottom 1.016: TP21.TP SJ22.2
N$171
  Bottom 1.016: SJ23.2 TP22.TP
N$172
  Bottom 1.016: SJ24.2 TP23.TP
N$173
  Bottom 1.016: TP24.TP SJ25.2
N$174
  Bottom 1.016: TP25.TP SJ26.2
N$175
  Bottom 1.016: TP26.TP SJ27.2
N$176
  Bottom 1.016: TP27.TP SJ28.2
N$177
  Bottom 1.016: TP28.TP SJ29.2
N$178
  Bottom 1.016: TP29.TP SJ30.2
N$179
  Bottom 1.016: TP30.TP SJ31.2
N$180
  Bottom 1.016: TP31.TP SJ32.2
N$181
  Bottom 1.016: TP32.TP SJ33.2
N$182
  Top 0.61: R9.03.1 38.72,18.24 U9.00.2
N$183
  Top 0.61: R9.04.1 40.72,18.17 U9.00.3
N$184
  Top 0.406: U9.02.5 68.61,13.15 69.06,12.7 69.06,9.68 | 69.06,9.68 R9.12.2 | R9.11.2 69.06,9.68
  Top 0.61: R9.16.1 R9.12.2
N$185
  Top 0.813: D9.04.C 67.05,29.16 67.05,22.6 65.09,20.64 61.59,20.64 60.48,19.53 R9.10.2
N$186
  Top 0.406: U9.02.3 64.02,12.49 63.18,13.33 63.18,15.08 64.14,16.03 R9.09.1 R9.10.1
N$187
  Top 0.61: D9.03.C 68.07,20.64 66.67,20.64 65.08,19.05 R9.09.2
N$188
  Top 0.61: R9.05.1 42.72,18.39 U9.00.4
RST
  Top 1.016: TP4.TP 20.64,44.15
  Bottom 0.61: U9.00.6 46.72,20.05 44.77,18.1 34.92,18.1 32.38,20.64 32.38,37.47 33.34,38.42 33.34,40.64 32.36,41.62 21.85,41.62 20.6,42.87 20.6,43.5 TP4.TP | SJ1.2 20.6,46.51
  Bottom 1.016: 20.6,46.51 20.6,43.5
SCL
  Top 0.813: 8.57,19.37 8.57,23.81 6.67,25.4 | 8.57,19.37 8.57,13.02 6.67,11.11 6.67,8.93 TP11.TP | R9.15.1 8.57,19.37
  Top 1.016: X9.01.3 6.67,25.4 X9.01.4
  Bottom 1.016: TP11.TP SJ9.2
SCLK
  Top 0.61: TP14.TP 21.85,10.9 23.18,12.22 37.46,12.22 40.8,15.4 R9.04.2
  Bottom 1.016: TP14.TP SJ15.2
SDA
  Top 0.813: 10.48,27.94 10.64,12.06 9.1,10.53 TP10.TP | R9.14.1 8.26,33.34 10.48,31.12 10.48,27.94 | X9.01.5 10.48,27.94
  Top 1.016: X9.01.6 X9.01.5
  Bottom 1.016: TP10.TP SJ10.2

### Text on the board
Dimension: CUT / OUT
tNames: N/C | IOREF | RST | +3V3 | +5V0 | GND | GND | +VIN | ADC0 | ADC1 | ADC2 | ADC3 | ADC4 | ADC5 | AUXLED | I2C VBUS / SELECT | 3V3 | 5V0 | VBUS | SDA | SCL | I2C BUS | GND | !CS | MISO | SCLK | MOSI | !PD | !LEDCTRL | SCL | SDA | AREF | GND | IO13 | IO12 | IO11 | IO10 | IO09 | IO08 | IO07 | IO06 | IO05 | IO04 | IO03 | IO02 | IO01 | IO00
bNames: SPFMDB | KITT DB-01 R1 | c | 2017 ESD'16